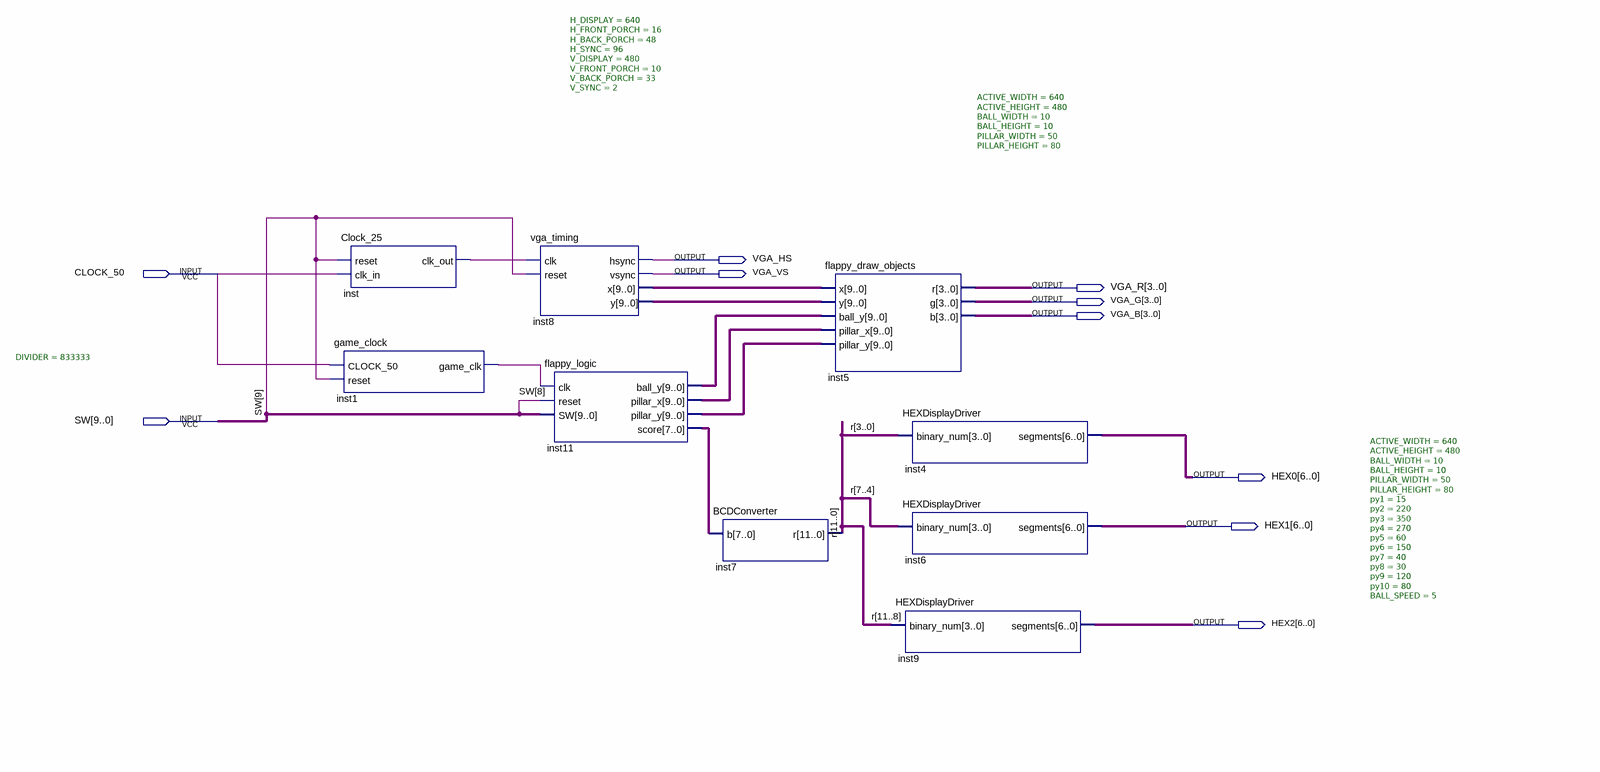
[diagram p0: schematic sheet]
// Quartus schematic top_level_flappy.bdf as structural Verilog: 9 symbols, 10 pins
module top_level_flappy (
  input  CLOCK_50,
  input  [9:0] SW,
  output VGA_HS,
  output VGA_VS,
  output [3:0] VGA_R,
  output [3:0] VGA_G,
  output [3:0] VGA_B,
  output [6:0] HEX0,
  output [6:0] HEX1,
  output [6:0] HEX2
);

  wire inst1_game_clk, inst_clk_out;
  wire [7:0] inst11_score;
  wire [9:0] inst8_x, inst8_y, inst11_ball_y, inst11_pillar_x, inst11_pillar_y;
  wire [11:0] r;

  Clock_25 inst (.reset(SW[9]), .clk_in(CLOCK_50), .clk_out(inst_clk_out));
  game_clock #(.DIVIDER(833333)) inst1 (.CLOCK_50(CLOCK_50), .reset(SW[9]), .game_clk(inst1_game_clk));
  vga_timing #(.H_DISPLAY(640), .H_FRONT_PORCH(16), .H_BACK_PORCH(48), .H_SYNC(96), .V_DISPLAY(480), .V_FRONT_PORCH(10), .V_BACK_PORCH(33), .V_SYNC(2)) inst8 (
    .clk(inst_clk_out), .reset(SW[9]), .hsync(VGA_HS), .vsync(VGA_VS), .x(inst8_x), .y(inst8_y));
  flappy_logic #(.ACTIVE_WIDTH(640), .ACTIVE_HEIGHT(480), .BALL_WIDTH(10), .BALL_HEIGHT(10), .PILLAR_WIDTH(50), .PILLAR_HEIGHT(80), .py1(15), .py2(220), .py3(350), .py4(270), .py5(60), .py6(150), .py7(40), .py8(30), .py9(120), .py10(80), .BALL_SPEED(5)) inst11 (
    .clk(inst1_game_clk), .reset(SW[8]), .SW(SW), .ball_y(inst11_ball_y), .pillar_x(inst11_pillar_x),
    .pillar_y(inst11_pillar_y), .score(inst11_score));
  BCDConverter inst7 (.b(inst11_score), .r(r));
  flappy_draw_objects #(.ACTIVE_WIDTH(640), .ACTIVE_HEIGHT(480), .BALL_WIDTH(10), .BALL_HEIGHT(10), .PILLAR_WIDTH(50), .PILLAR_HEIGHT(80)) inst5 (
    .x(inst8_x), .y(inst8_y), .ball_y(inst11_ball_y), .pillar_x(inst11_pillar_x), .pillar_y(inst11_pillar_y),
    .r(VGA_R), .g(VGA_G), .b(VGA_B));
  HEXDisplayDriver inst4 (.binary_num(r[3:0]), .segments(HEX0));
  HEXDisplayDriver inst6 (.binary_num(r[7:4]), .segments(HEX1));
  HEXDisplayDriver inst9 (.binary_num(r[11:8]), .segments(HEX2));
endmodule
